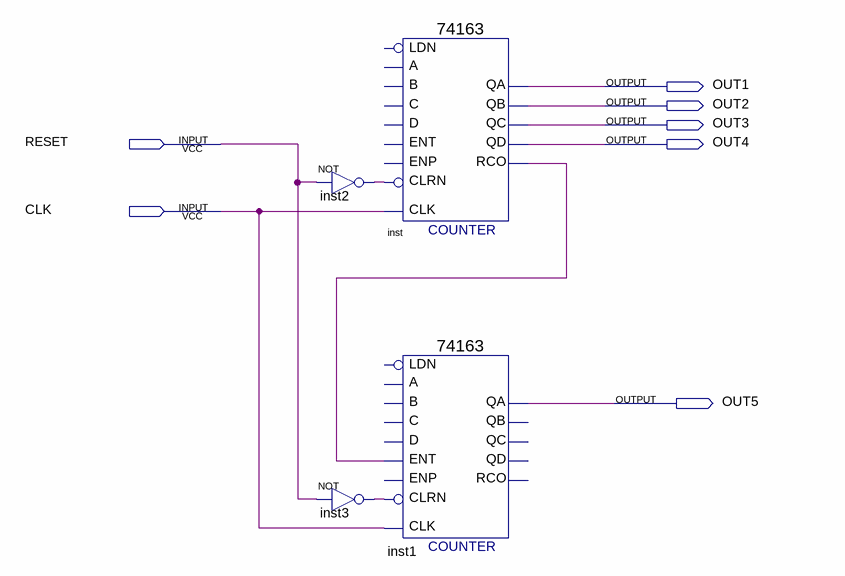
[diagram p0: schematic sheet]
// Quartus schematic T-COUNTER.bdf as structural Verilog: 4 symbols, 7 pins
module \T-COUNTER  (
  input  RESET,
  input  CLK,
  output OUT1,
  output OUT2,
  output OUT3,
  output OUT4,
  output OUT5
);

  wire inst2_out, inst3_out, inst_rco;

  not inst2 (inst2_out, RESET);
  not inst3 (inst3_out, RESET);
  \74163  inst (
    .CLRN(inst2_out), .CLK(CLK), .QA(OUT1), .QB(OUT2), .QC(OUT3), .QD(OUT4), .RCO(inst_rco));  // open: C, B, A, ENT, D, ENP, LDN
  \74163  inst1 (
    .ENT(inst_rco), .CLRN(inst3_out), .CLK(CLK), .QA(OUT5));  // open: C, B, A, D, ENP, LDN, QB, QC, QD, RCO
endmodule
